# EAGLE schematic Topplateschematc (EAGLE 7.5.0)
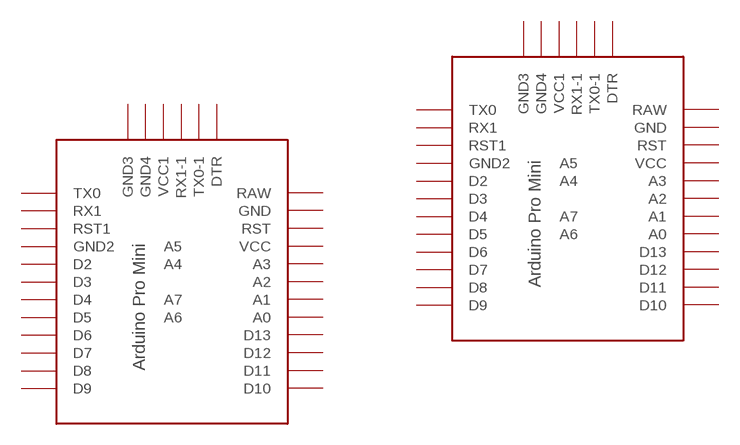
[diagram p0: schematic, sheet 1]

## Parts
MASTER  PRO-MINI-2  [PRO-MINI-2]
SLAVE  PRO-MINI-2  [PRO-MINI-2]
Unconnected: MASTER.A0 MASTER.A1 MASTER.A2 MASTER.A3 MASTER.A4 MASTER.A5 MASTER.A6 MASTER.A7 MASTER.D2 MASTER.D3 MASTER.D4 MASTER.D5 MASTER.D6 MASTER.D7 MASTER.D8 MASTER.D9 MASTER.D10 MASTER.D11 MASTER.D12 MASTER.D13 MASTER.DTR MASTER.GND MASTER.GND1(GND2) MASTER.GND2(GND3) MASTER.GND3(GND4) MASTER.RAW MASTER.RST MASTER.RST1 MASTER.RX1 MASTER.RX1-1 MASTER.TX0 MASTER.TX0-1 MASTER.VCC MASTER.VCC1 SLAVE.A0 SLAVE.A1 SLAVE.A2 SLAVE.A3 SLAVE.A4 SLAVE.A5 SLAVE.A6 SLAVE.A7 SLAVE.D2 SLAVE.D3 SLAVE.D4 SLAVE.D5 SLAVE.D6 SLAVE.D7 SLAVE.D8 SLAVE.D9 SLAVE.D10 SLAVE.D11 SLAVE.D12 SLAVE.D13 SLAVE.DTR SLAVE.GND SLAVE.GND1(GND2) SLAVE.GND2(GND3) SLAVE.GND3(GND4) SLAVE.RAW SLAVE.RST SLAVE.RST1 SLAVE.RX1 SLAVE.RX1-1 SLAVE.TX0 SLAVE.TX0-1 SLAVE.VCC SLAVE.VCC1

## Library data of the parts
MASTER SLAVE = Arduino-clone:PRO-MINI-2: Arduino Pro Mini Layout 2 Sparkfun.com